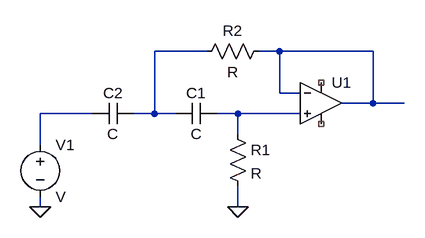
[diagram p0: schematic Draft1.asc]
Draft1.asc, the LTspice schematic file:
Version 4
SHEET 1 880 680
WIRE 64 64 -16 64
WIRE 176 64 144 64
WIRE 320 64 176 64
WIRE 176 128 176 64
WIRE 208 128 176 128
WIRE 320 144 320 64
WIRE 320 144 272 144
WIRE 368 144 320 144
WIRE -112 160 -192 160
WIRE -16 160 -16 64
WIRE -16 160 -48 160
WIRE 16 160 -16 160
WIRE 112 160 80 160
WIRE 208 160 112 160
WIRE 112 192 112 160
WIRE -192 208 -192 160
WIRE -192 304 -192 288
WIRE 112 304 112 272
FLAG 112 304 0
FLAG -192 304 0
SYMBOL OpAmps\\UniversalOpAmp 240 144 R0
SYMATTR InstName U1
SYMBOL res 96 176 R0
SYMATTR InstName R1
SYMBOL res 160 48 R90
WINDOW 0 0 56 VBottom 2
WINDOW 3 32 56 VTop 2
SYMATTR InstName R2
SYMBOL cap 80 144 R90
WINDOW 0 0 32 VBottom 2
WINDOW 3 32 32 VTop 2
SYMATTR InstName C1
SYMBOL cap -48 144 R90
WINDOW 0 0 32 VBottom 2
WINDOW 3 32 32 VTop 2
SYMATTR InstName C2
SYMBOL voltage -192 192 R0
SYMATTR InstName V1

The netlist it stands for:
* Draft1.asc
XU1 N004 N002 NC_01 NC_02 N002 level1 Avol=1Meg GBW=10Meg Vos=0 En=0 Enk=0 In=0 Ink=0 Rin=500Meg  ; pins In+ In- V+ V- OUT
R1 N004 0 R
R2 N002 N001 R
C1 N004 N001 C
C2 N001 N003 C
V1 N003 0 V
.lib UniversalOpAmp1.lib
.backanno
.end